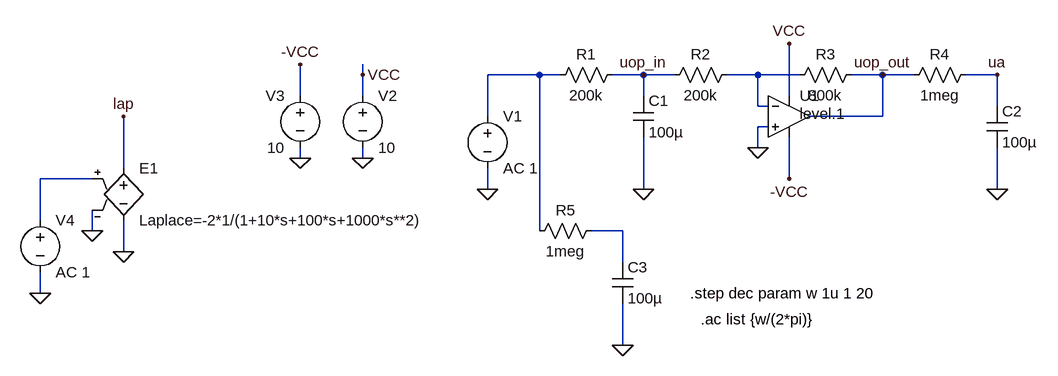
[diagram p0: schematic op_tp_N_2.asc]
op_tp_N_2.asc, the LTspice schematic file:
Version 4
SHEET 1 880 680
WIRE -224 -256 -224 -272
WIRE 48 -256 -32 -256
WIRE 80 -256 48 -256
WIRE 208 -256 160 -256
WIRE 256 -256 208 -256
WIRE 384 -256 336 -256
WIRE 448 -256 384 -256
WIRE 576 -256 528 -256
WIRE 624 -256 576 -256
WIRE 752 -256 704 -256
WIRE -320 -224 -320 -272
WIRE -224 -224 -224 -256
WIRE 208 -224 208 -256
WIRE 432 -224 432 -304
WIRE 384 -208 384 -256
WIRE 400 -208 384 -208
WIRE 752 -208 752 -256
WIRE -32 -192 -32 -256
WIRE 576 -192 576 -256
WIRE 576 -192 464 -192
WIRE 400 -176 384 -176
WIRE 384 -144 384 -176
WIRE -320 -128 -320 -144
WIRE -224 -128 -224 -144
WIRE -592 -112 -592 -192
WIRE -640 -96 -720 -96
WIRE 432 -96 432 -160
WIRE -32 -80 -32 -112
WIRE 208 -80 208 -160
WIRE 752 -80 752 -144
WIRE -720 -32 -720 -96
WIRE -640 -16 -640 -48
WIRE 48 -16 48 -256
WIRE 176 -16 128 -16
WIRE -592 16 -592 -32
WIRE 176 32 176 -16
WIRE -720 80 -720 48
WIRE 176 160 176 96
FLAG -32 -80 0
FLAG 208 -80 0
FLAG 752 -80 0
FLAG 384 -144 0
FLAG -224 -128 0
FLAG -224 -256 VCC
FLAG -320 -128 0
FLAG -320 -272 -VCC
FLAG 432 -304 VCC
FLAG 432 -96 -VCC
FLAG -720 80 0
FLAG -640 -16 0
FLAG -592 16 0
FLAG -592 -192 lap
FLAG 752 -256 ua
FLAG 576 -256 uop_out
FLAG 208 -256 uop_in
FLAG 176 160 0
SYMBOL res 176 -272 R90
WINDOW 0 0 56 VBottom 0
WINDOW 3 32 56 VTop 0
SYMATTR InstName R1
SYMATTR Value 200k
SYMBOL cap 192 -224 R0
SYMATTR InstName C1
SYMATTR Value 100µ
SYMBOL res 352 -272 R90
WINDOW 0 0 56 VBottom 0
WINDOW 3 32 56 VTop 0
SYMATTR InstName R2
SYMATTR Value 200k
SYMBOL res 544 -272 R90
WINDOW 0 0 56 VBottom 0
WINDOW 3 32 56 VTop 0
SYMATTR InstName R3
SYMATTR Value 800k
SYMBOL res 720 -272 R90
WINDOW 0 0 56 VBottom 0
WINDOW 3 32 56 VTop 0
SYMATTR InstName R4
SYMATTR Value 1meg
SYMBOL cap 736 -208 R0
SYMATTR InstName C2
SYMATTR Value 100µ
SYMBOL voltage -32 -208 R0
WINDOW 123 0 0 Left 0
WINDOW 39 0 0 Left 0
SYMATTR InstName V1
SYMATTR Value AC 1
SYMBOL voltage -224 -240 R0
WINDOW 123 0 0 Left 0
WINDOW 39 0 0 Left 0
SYMATTR InstName V2
SYMATTR Value 10
SYMBOL voltage -320 -240 M0
WINDOW 123 0 0 Left 0
WINDOW 39 0 0 Left 0
SYMATTR InstName V3
SYMATTR Value 10
SYMBOL Opamps\\UniversalOpamp2 432 -192 R0
WINDOW 38 16 -4 Left 0
SYMATTR InstName U1
SYMATTR SpiceModel level.1
SYMBOL e -592 -128 R0
SYMATTR InstName E1
SYMATTR Value Laplace=-2*1/(1+10*s+100*s+1000*s**2)
SYMBOL voltage -720 -48 R0
WINDOW 123 0 0 Left 0
WINDOW 39 0 0 Left 0
SYMATTR InstName V4
SYMATTR Value AC 1
SYMBOL res 144 -32 R90
WINDOW 0 0 56 VBottom 0
WINDOW 3 32 56 VTop 0
SYMATTR InstName R5
SYMATTR Value 1meg
SYMBOL cap 160 32 R0
SYMATTR InstName C3
SYMATTR Value 100µ
TEXT 280 80 Left 0 !.step dec param w 1u 1 20
TEXT 296 120 Left 0 !.ac list {w/(2*pi)}

The netlist it stands for:
* op_tp_N_2.asc
R1 uop_in N001 200k
C1 uop_in 0 100µ
R2 N002 uop_in 200k
R3 uop_out N002 800k
R4 ua uop_out 1meg
C2 ua 0 100µ
V1 N001 0 AC 1
V2 VCC 0 10
V3 -VCC 0 10
XU1 0 N002 VCC -VCC uop_out level.1 Avol=1Meg GBW=10Meg Slew=10Meg ilimit=25m rail=0 Vos=0 phimargin=45 en=0 enk=0 in=0 ink=0 Rin=500Meg  ; pins IN+ IN- V+ V- OUT
E1 lap 0 N003 0 Laplace=-2*1/(1+10*s+100*s+1000*s**2)
V4 N003 0 AC 1
R5 N004 N001 1meg
C3 N004 0 100µ
.step dec param w 1u 1 20
.ac list {w/(2*pi)}
.lib UniversalOpamps2.sub
.backanno
.end